# Altium schematic sheet H bridge.SchDoc
size A
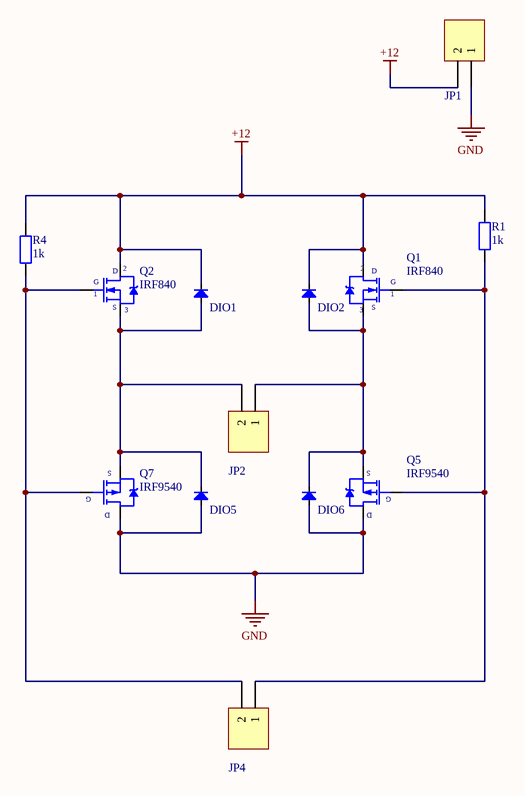
[diagram p0: H bridge.SchDoc]

## Parts
DIO1  Diode SMD  [DIO-SMD-106]  (value not drawn)
DIO2  Diode SMD  [DIO-SMD-106]  (value not drawn)
DIO5  Diode SMD  [DIO-SMD-106]  (value not drawn)
DIO6  Diode SMD  [DIO-SMD-106]  (value not drawn)
JP1  Header 2_1  [HED2]  (value not drawn)
JP2  Header 2_1  [HED2]  (value not drawn)
JP4  Header 2_1  [HED2]  (value not drawn)
Q1  IRF840  [QTO-220]
Q2  IRF840  [QTO-220]
Q5  IRF9540  [QTO-220]
Q7  IRF9540  [QTO-220]
R1  1k  [R1/4W]
R4  1k  [R1/4W]

## Nets
+12: DIO1.2(K) DIO2.2(K) JP1.2 Q1.2(D) Q2.2(D) R1.2 R4.2
GND: DIO5.1(A) DIO6.1(A) JP1.1 Q5.2(D) Q7.2(D)
NetDIO1_1: DIO1.1(A) DIO5.2(K) JP2.2 Q2.3(S) Q7.3(S)
NetDIO2_1: DIO2.1(A) DIO6.2(K) JP2.1 Q1.3(S) Q5.3(S)
NetJP4_1: JP4.1 Q1.1(G) Q5.1(G) R1.1
NetJP4_2: JP4.2 Q2.1(G) Q7.1(G) R4.1

## Library data of the parts
DIO1 DIO2 DIO5 DIO6 = Diode SMD: Default Diode; Code - JEDEC: DO-214-AB; Value: 1N5007; Published: 8-Jun-2000; Revision: July-2002: Re-released for DXP Platform.; Publisher: Altium Limited
JP1 JP2 JP4 = Header 2_1: Header, 2-Pin; Manufacturer: Generic Components; Class: Connector; Value: Header 2
Q1 Q2 = IRF840: MOSFET N - CHANNEL 500V - 0.75 - 8A - TO-220; Value: IRF840
Q5 Q7 = IRF9540: HEXFET P-Channel Power MOSFET; Note: Pin 2 is electrically connected to pin 4.; Published: 8-Jun-2000; LatestRevisionDate: 17-Jul-2002; LatestRevisionNote: Re-released for DXP Platform.; DatasheetVersion: PD-9.421C; PackageVersion: Feb-1997; PackageReference: TO-220AB; Publisher: Altium Limited; PackageDescription: TO, Thru-Hole, Vertical, Heatsink Mounted; 3 In-Line Leads; Pitch 2.54 mm; ComponentLink1Description: Manufacturer Link; ComponentLink1URL: http://www.irf.com/; ComponentLink2Description: Datasheet; ComponentLink2URL: http://www.irf.com/product-info/datasheets/data/irf9540.pdf
R1 R4 = R1/4W: Resistor 1/4W; Value: R1/4W - 1K